# Altium schematic sheet [05] - FLASH, MICROSD.SchDoc
size A3; DocumentNumber: 6; SheetNumber: 5; SheetTotal: 10
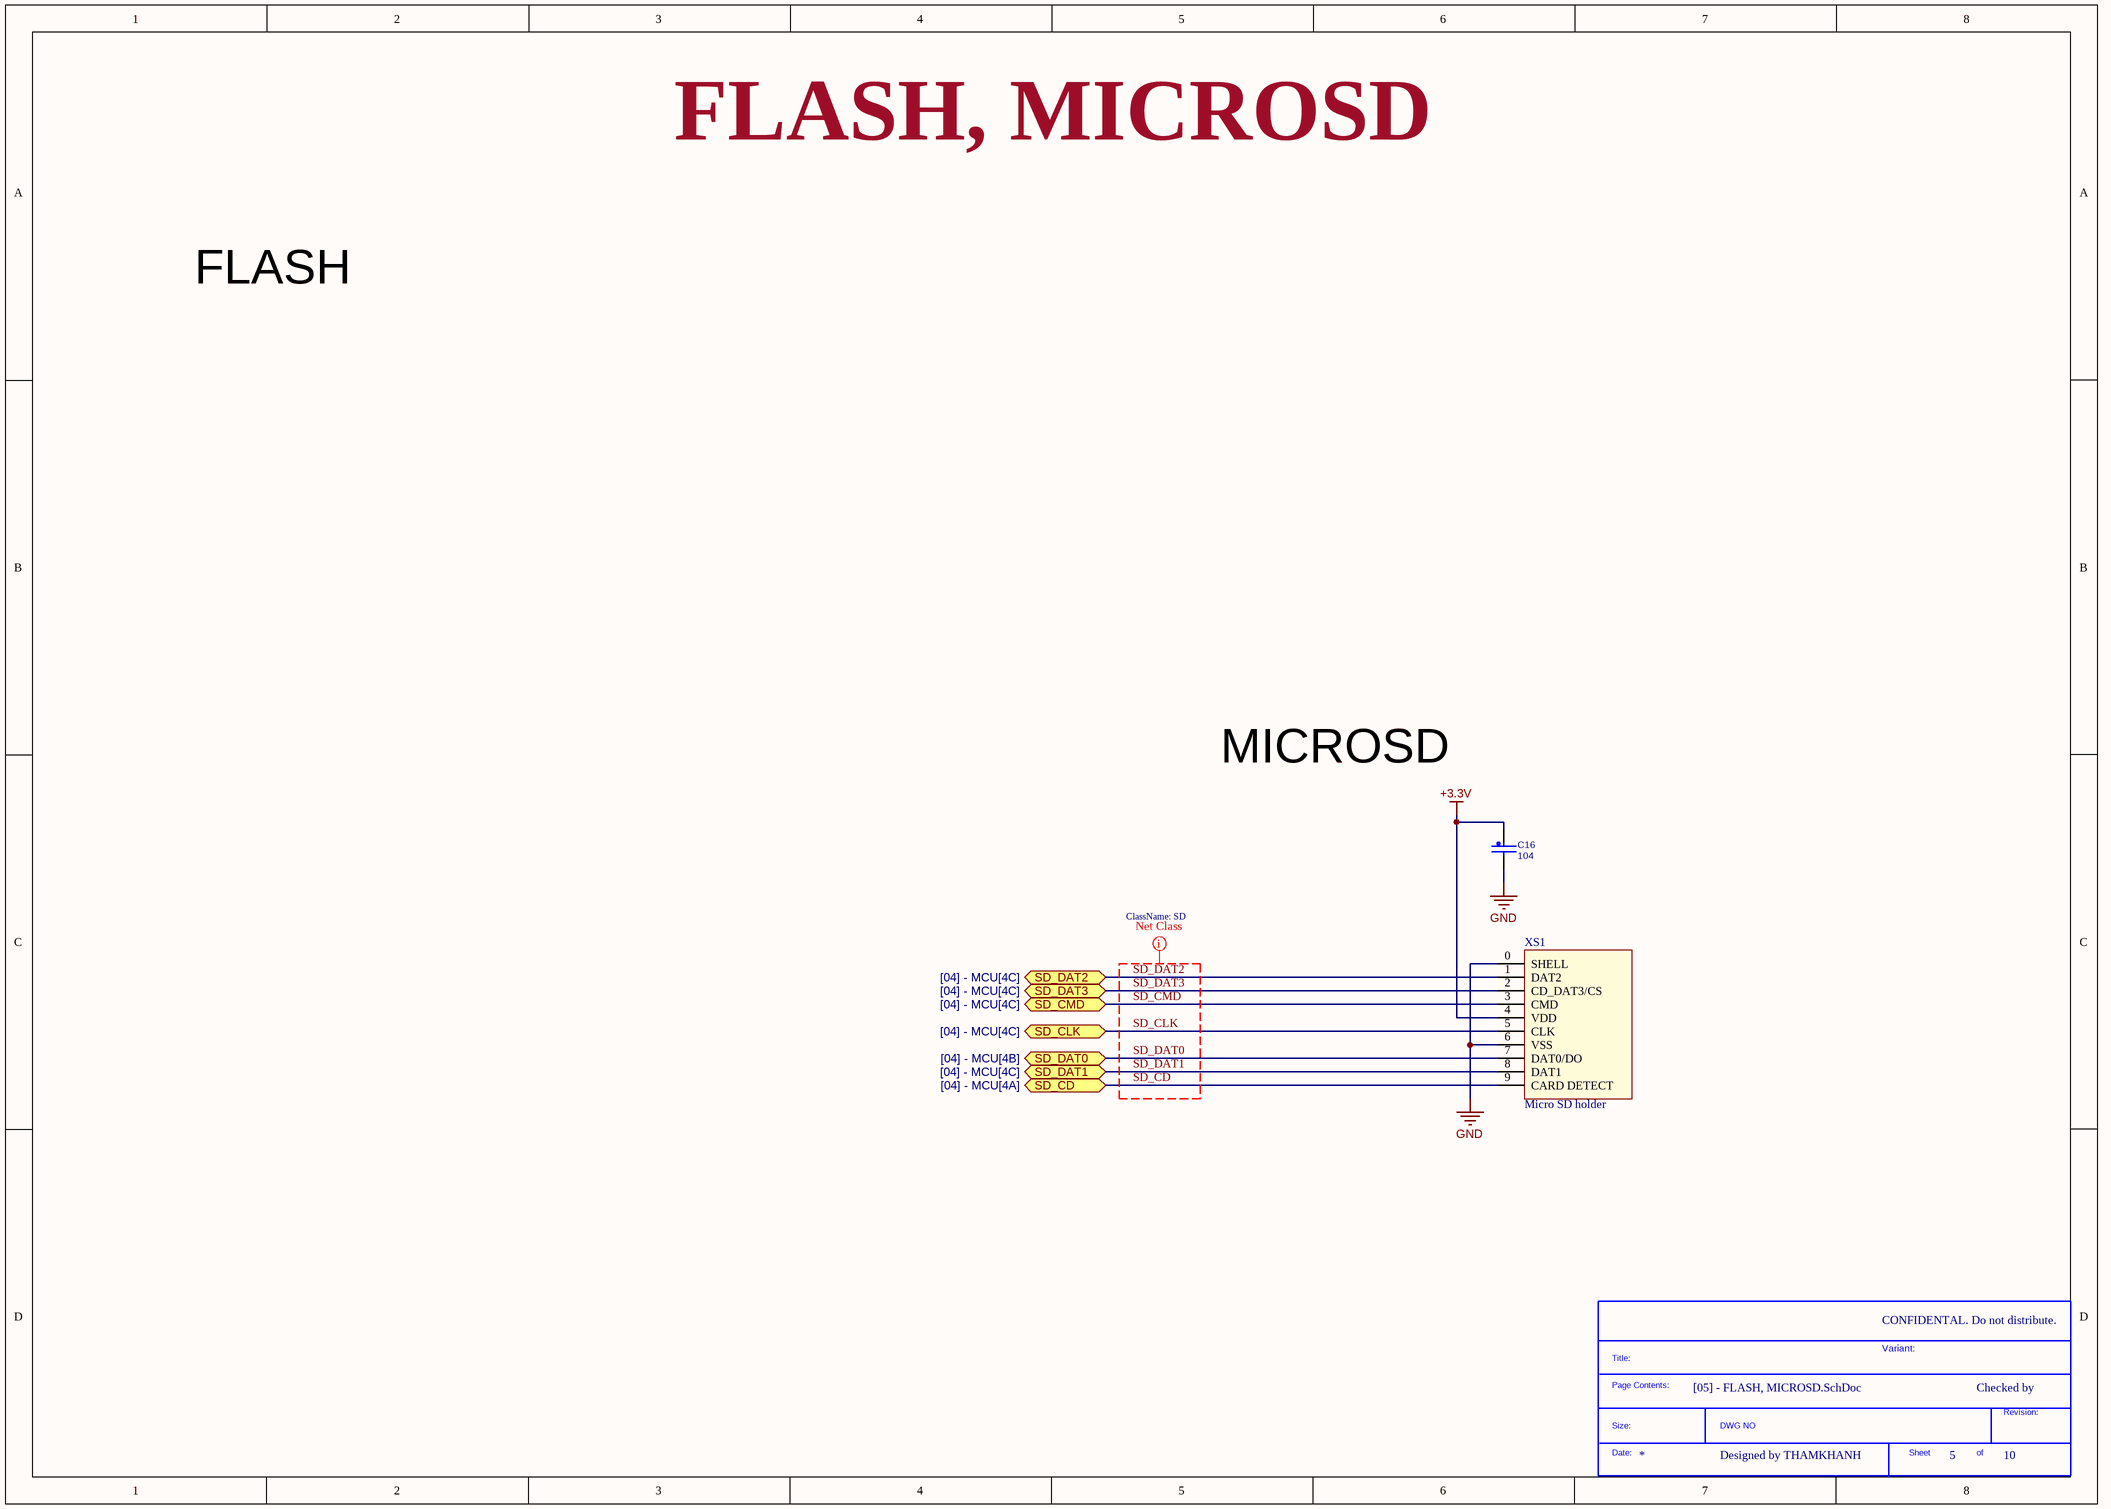
[diagram p0: [05] - FLASH, MICROSD.SchDoc]

## Parts
*?  SDTitleBlock  (value not drawn)  (graphical)
C16  104  [C0603]
XS1  Micro SD holder  [SD-CARD-MICRO-V3]

## Ports
SD_CD (bidir, see [04] - MCU[4A]), SD_CLK (bidir, see [04] - MCU[4C]), SD_CMD (bidir, see [04] - MCU[4C]), SD_DAT0 (bidir, see [04] - MCU[4B]), SD_DAT1 (bidir, see [04] - MCU[4C]), SD_DAT2 (bidir, see [04] - MCU[4C]), SD_DAT3 (bidir, see [04] - MCU[4C])

## Nets
+3.3V: C16.1 XS1.4(VDD)
GND: C16.2 XS1.0(SHELL) XS1.6(VSS)
SD_CD: XS1.9(CARD_DETECT) ; port SD_CD
SD_CLK: XS1.5(CLK) ; port SD_CLK
SD_CMD: XS1.3(CMD) ; port SD_CMD
SD_DAT0: XS1.7(DAT0/DO) ; port SD_DAT0
SD_DAT1: XS1.8(DAT1) ; port SD_DAT1
SD_DAT2: XS1.1(DAT2) ; port SD_DAT2
SD_DAT3: XS1.2(CD_DAT3/CS) ; port SD_DAT3

## Layout directives
net class SD: SD_CD, SD_CLK, SD_CMD, SD_DAT0, SD_DAT1, SD_DAT2, SD_DAT3

## Notes on the sheet
- FLASH, MICROSD
- FLASH
- MICROSD
- CONFIDENTAL. Do not distribute.
- Variant:
- Checked by
- Designed by THAMKHANH
- (in symbol SDTitleBlock) Title:; Page Contents:; Revision:; Size:; DWG NO; Date:; Sheet; of

## Library data of the parts
C16 = CAP-SMD-CERAMIC: Surface Mound Multilayer Ceramic Chip Capacitor (SMD MLCC); Manufacturer: TDK Corporation; Manufacturer Part Number: C2012X5R1C226K; Capacitance: 22pF; Voltage - Rated: 16V; Tolerance: ±10%; Temperature Coefficient: X5R; .Checked PCB: RF; RoHS: RoHS Compliant; Category: Capacitors; Mounting Type: Surface Mount, MLCC; Operating Temperature: -55°C ~ 85°C; Applications: General Purpose; Ratings: -; Package / Case: 0805 (2012 Metric); Size / Dimension: 0.079" L x 0.049" W (2.00mm x 1.25mm); Height - Seated (Max): -; Thickness (Max): 0.057" (1.45mm); Lead Spacing: -; Features: -; Packaging: Cut Tape (CT); Lead Style: -; ComponentLink1URL: http://www.tdk.com/pdf/general_B11.pdf; ComponentLink1Description: http://www.tdk.com/pdf/general_B11.pdf; .Checked SCH: RF
XS1 = SD-CARD-v3